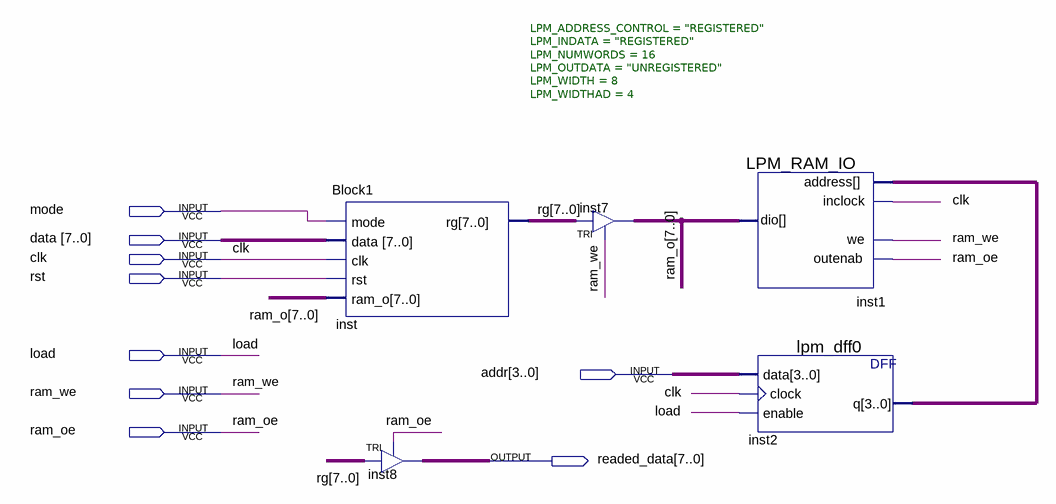
[diagram p0: schematic sheet]
// Quartus schematic Block2.bdf as structural Verilog: 5 symbols, 9 pins
module Block2 (
  input  mode,
  input  [7:0] data,
  input  clk,
  input  rst,
  input  load,
  input  [3:0] addr,
  input  ram_we,
  input  ram_oe,
  output [7:0] readed_data
);

  wire [3:0] inst2_q;
  wire [7:0] ram_o, rg;

  Block1 inst (.mode(mode), .clk(clk), .rst(rst), .data(data), .ram_o(ram_o), .rg(rg));
  TRI inst8[7:0] (.IN(rg), .OE(ram_oe), .OUT(readed_data));
  TRI inst7[7:0] (.IN(rg), .OE(ram_we), .OUT(ram_o));
  LPM_RAM_IO #(.LPM_ADDRESS_CONTROL("REGISTERED"), .LPM_INDATA("REGISTERED"), .LPM_NUMWORDS(16), .LPM_OUTDATA("UNREGISTERED"), .LPM_WIDTH(8), .LPM_WIDTHAD(4)) inst1 (
    .address(inst2_q), .inclock(clk), .we(ram_we), .outenab(ram_oe), .dio(ram_o));
  lpm_dff0 inst2 (.data(addr), .clock(clk), .enable(load), .q(inst2_q));
endmodule
